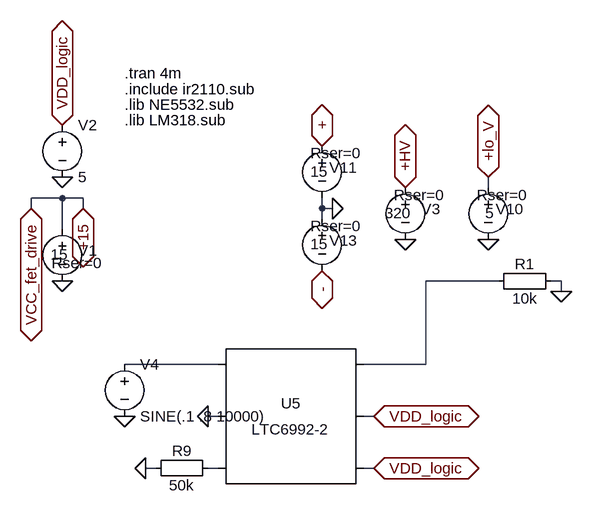
[diagram p0: schematic LTC6992-2_PWM.asc]
LTC6992-2_PWM.asc, the LTspice schematic file:
Version 4
SHEET 1 6068 1612
WIRE 816 -1760 816 -1776
WIRE 160 -1744 112 -1744
WIRE 192 -1744 160 -1744
WIRE 112 -1728 112 -1744
WIRE 192 -1728 192 -1744
WIRE 560 -1728 560 -1744
WIRE 576 -1728 560 -1728
WIRE 560 -1712 560 -1728
WIRE 160 -1696 160 -1744
WIRE 832 -1616 720 -1616
WIRE 928 -1616 912 -1616
WIRE 928 -1600 928 -1616
WIRE 400 -1488 256 -1488
WIRE 720 -1488 720 -1616
WIRE 720 -1488 624 -1488
WIRE 400 -1408 384 -1408
WIRE 640 -1408 624 -1408
WIRE 304 -1328 288 -1328
WIRE 400 -1328 384 -1328
WIRE 640 -1328 624 -1328
FLAG 192 -1728 +15
IOPIN 192 -1728 BiDir
FLAG 160 -1616 0
FLAG 160 -1776 0
FLAG 160 -1856 VDD_logic
IOPIN 160 -1856 BiDir
FLAG 688 -1760 +HV
IOPIN 688 -1760 BiDir
FLAG 688 -1680 0
FLAG 816 -1776 +lo_V
IOPIN 816 -1776 BiDir
FLAG 816 -1680 0
FLAG 112 -1728 VCC_fet_drive
IOPIN 112 -1728 BiDir
FLAG 384 -1408 0
FLAG 288 -1328 0
FLAG 640 -1408 VDD_logic
IOPIN 640 -1408 BiDir
FLAG 560 -1632 -
IOPIN 560 -1632 BiDir
FLAG 576 -1728 0
FLAG 560 -1824 +
IOPIN 560 -1824 BiDir
FLAG 640 -1328 VDD_logic
IOPIN 640 -1328 BiDir
FLAG 928 -1600 0
FLAG 256 -1408 0
SYMBOL voltage 160 -1712 M0
WINDOW 123 0 0 Left 2
WINDOW 39 -62 68 Left 2
WINDOW 0 -54 49 Left 2
WINDOW 3 -9 55 Left 2
SYMATTR SpiceLine Rser=0
SYMATTR InstName V1
SYMATTR Value 15
SYMBOL voltage 160 -1872 R0
WINDOW 123 0 0 Left 2
WINDOW 39 0 0 Left 2
SYMATTR InstName V2
SYMATTR Value 5
SYMBOL voltage 688 -1776 M0
WINDOW 123 0 0 Left 2
WINDOW 39 -61 27 Left 2
WINDOW 0 -54 49 Left 2
WINDOW 3 -9 55 Left 2
SYMATTR SpiceLine Rser=0
SYMATTR InstName V3
SYMATTR Value 320
SYMBOL voltage 816 -1776 M0
WINDOW 123 0 0 Left 2
WINDOW 39 -61 27 Left 2
WINDOW 0 -54 49 Left 2
WINDOW 3 -9 55 Left 2
SYMATTR SpiceLine Rser=0
SYMATTR InstName V10
SYMATTR Value 5
SYMBOL SpecialFunctions\\LTC6992-2 512 -1408 R0
SYMATTR InstName U5
SYMBOL voltage 560 -1840 M0
WINDOW 123 0 0 Left 2
WINDOW 39 -61 27 Left 2
WINDOW 0 -54 49 Left 2
WINDOW 3 -9 55 Left 2
SYMATTR SpiceLine Rser=0
SYMATTR InstName V11
SYMATTR Value 15
SYMBOL voltage 560 -1728 M0
WINDOW 123 0 0 Left 2
WINDOW 39 -61 27 Left 2
WINDOW 0 -54 49 Left 2
WINDOW 3 -9 55 Left 2
SYMATTR SpiceLine Rser=0
SYMATTR InstName V13
SYMATTR Value 15
SYMBOL Misc\\EuropeanResistor 288 -1344 M90
WINDOW 0 5 56 VBottom 2
WINDOW 3 27 56 VTop 2
SYMATTR InstName R9
SYMATTR Value 50k
SYMBOL Misc\\EuropeanResistor 816 -1600 R270
WINDOW 0 27 56 VTop 2
WINDOW 3 5 56 VBottom 2
SYMATTR InstName R1
SYMATTR Value 10k
SYMBOL voltage 256 -1504 R0
WINDOW 123 0 0 Left 2
WINDOW 39 0 0 Left 2
SYMATTR InstName V4
SYMATTR Value SINE(.1 .8 10000)
TEXT 256 -1912 Left 2 !.include ir2110.sub
TEXT 256 -1888 Left 2 !.lib NE5532.sub
TEXT 256 -1864 Left 2 !.lib LM318.sub
TEXT 256 -1936 Left 2 !.tran 4m

The netlist it stands for:
* LTC6992-2_PWM.asc
V1 VCC_fet_drive 0 15 Rser=0
V2 VDD_logic 0 5
V3 +HV 0 320 Rser=0
V10 +lo_V 0 5 Rser=0
XU5 N002 0 N003 VDD_logic VDD_logic N001 LTC6992-2
V11 + 0 15 Rser=0
V13 0 - 15 Rser=0
R9 0 N003 50k
R1 N001 0 10k
V4 N002 0 SINE(.1 .8 10000)
.include ir2110.sub
.lib NE5532.sub
.lib LM318.sub
.tran 4m
.lib LTC6992-2.sub
.backanno
.end